# Altium schematic sheet InputConn.SchDoc
size A; SheetNumber: 4; SheetTotal: 4
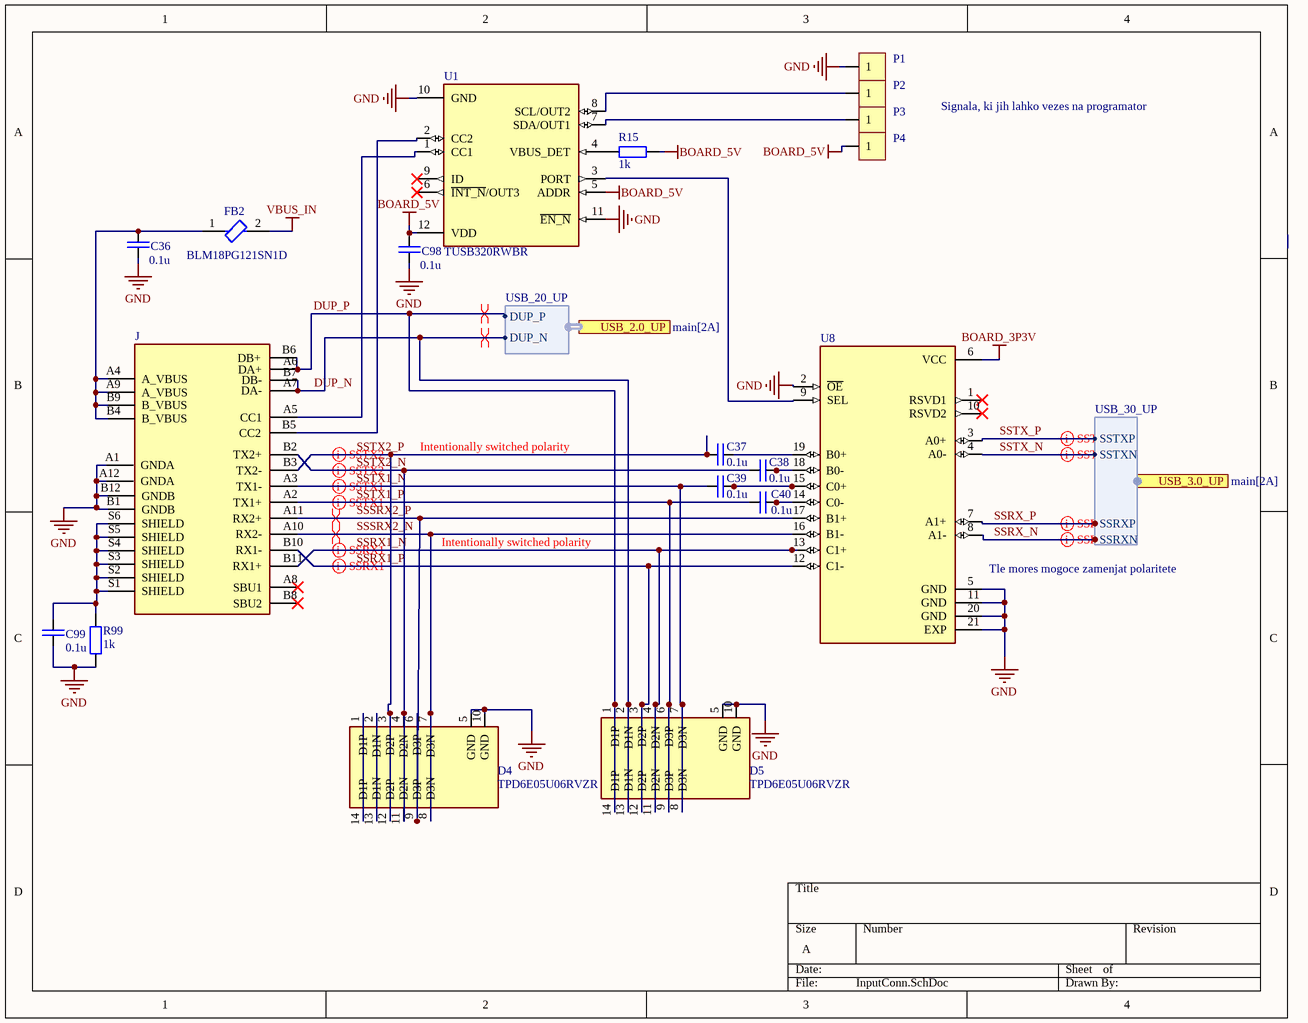
[diagram p0: InputConn.SchDoc]

## Parts
C36  value 0.1u  [CAP_0603_N]  (hidden comment: comment)
C37  value 0.1u  [CAP_0603_N]  (hidden comment: comment)
C38  value 0.1u  [CAP_0603_N]  (hidden comment: comment)
C39  value 0.1u  [CAP_0603_N]  (hidden comment: comment)
C40  value 0.1u  [CAP_0603_N]  (hidden comment: comment)
C98  value 0.1u  [CAP_0603_N]  (hidden comment: comment)
C99  value 0.1u  [CAP_0603_N]  (hidden comment: comment)
D4  TPD6E05U06RVZR  [SON50P135X350X55-14N]
D5  TPD6E05U06RVZR  [SON50P135X350X55-14N]
FB2  BLM18PG121SN1D  [FP-BLM18-0_15-t0_8-IPC_B]
J  (no value)  [JAE_DX07B024JJ3R1600]
P1  H1x1  [HDR1X1]  (value not drawn)
P2  H1x1  [HDR1X1]  (value not drawn)
P3  H1x1  [HDR1X1]  (value not drawn)
P4  H1x1  [HDR1X1]  (value not drawn)
R15  value 1k  [SMD_0603_N]  (hidden comment: comment)
R99  value 1k  [SMD_0603_N]  (hidden comment: comment)
U1  TUSB320RWBR  [IC_TUSB320RWBR]
U8  (no value)  [QFN50P450X250X100-21N]

## Ports
USB_2.0_UP (harness USB_20_UP, see main[2A]), USB_3.0_UP (harness USB_30_UP, see main[2A])

## Harnesses
USB_30_UP: SSTXP, SSTXN, SSRXP, SSRXN
USB_20_UP: DUP_P, DUP_N

## Nets
BOARD_3P3V: U8.6(VCC)
BOARD_5V: C98.1 P4.1 R15.2 U1.5(ADDR) U1.12(VDD)
GND: C36.2 C98.2 C99.1 D4.5(GND) D4.10(GND) D5.5(GND) D5.10(GND) J.A1(GNDA) J.A12(GNDA) J.B1(GNDB) J.B12(GNDB) P1.1 R99.1 U1.10(GND) U1.11(~{EN_N}) U8.2(~{OE}) U8.5(GND) U8.11(GND) U8.20(GND) U8.21(EXP)
VBUS_IN: FB2.2
DUP_N: D5.2(D1N) D5.13(D1N) J.A7(DA-) J.B7(DB-) ; port USB_2.0_UP.DUP_N
DUP_P: D5.1(D1P) D5.14(D1P) J.A6(DA+) J.B6(DB+) ; port USB_2.0_UP.DUP_P
SSRX1_N: D5.4(D2N) D5.11(D2N) J.B11(RX1+) U8.13(C1+)
SSRX1_P: D5.3(D2P) D5.12(D2P) J.B10(RX1-) U8.12(C1-)
SSRX_N: U8.8(A1-) ; port USB_3.0_UP.SSRXN
SSRX_P: U8.7(A1+) ; port USB_3.0_UP.SSRXP
SSSRX2_N: D4.7(D3N) D4.8(D3N) J.A10(RX2-) U8.16(B1-)
SSSRX2_P: D4.6(D3P) D4.9(D3P) J.A11(RX2+) U8.17(B1+)
SSTX1_N: C39.1 D5.7(D3N) D5.8(D3N) J.A3(TX1-)
SSTX1_P: C40.1 D5.6(D3P) D5.9(D3P) J.A2(TX1+)
SSTX2_N: C38.1 D4.4(D2N) D4.11(D2N) J.B2(TX2+)
SSTX2_P: C37.1 D4.3(D2P) D4.12(D2P) J.B3(TX2-)
SSTX_N: U8.4(A0-) ; port USB_3.0_UP.SSTXN
SSTX_P: U8.3(A0+) ; port USB_3.0_UP.SSTXP
NetC36_1: C36.1 FB2.1 J.A4(A_VBUS) J.A9(A_VBUS) J.B4(B_VBUS) J.B9(B_VBUS)
NetC37_2: C37.2 U8.19(B0+)
NetC38_2: C38.2 U8.18(B0-)
NetC39_2: C39.2 U8.15(C0+)
NetC40_2: C40.2 U8.14(C0-)
NetC99_2: C99.2 J.S1(SHIELD) J.S2(SHIELD) J.S3(SHIELD) J.S4(SHIELD) J.S5(SHIELD) J.S6(SHIELD) R99.2
NetD4_1: D4.1(D1P) D4.14(D1P)
NetD4_2: D4.2(D1N) D4.13(D1N)
NetJ_A5: J.A5(CC1) U1.1(CC1)
NetJ_B5: J.B5(CC2) U1.2(CC2)
NetP2_1: P2.1 U1.8(SCL/OUT2)
NetP3_1: P3.1 U1.7(SDA/OUT1)
NetR15_1: R15.1 U1.4(VBUS_DET)
NetU1_3: U1.3(PORT) U8.9(SEL)

Not connected (* = marked no-connect by the designer): J A8(SBU1)* B8(SBU2)*; U1 6(~{INT_N}/OUT3)* 9(ID)*; U8 1(RSVD1)* 10(RSVD2)*

## Layout directives
differential pair: DUP_N, DUP_P, SSRX1_N, SSRX1_P, SSRX_N, SSRX_P, SSSRX2_N, SSSRX2_P, SSTX1_N, SSTX1_P, SSTX2_N, SSTX2_P, SSTX_N, SSTX_P

## Notes on the sheet
- Signala, ki jih lahko vezes na programator
- Intentionally switched polarity
- (near U8) Tle mores mogoce zamenjat polaritete

## Library data of the parts
C36-C40 C98 C99 = Capacitor non-polarized
D4 D5 = TPD6E05U06RVZR: 6-Channel Ultra low capacitance IEC ESD protection diodes 14-USON -40 to 125; MP: TPD6E05U06RVZR; Price: None; Package: None; Value: *; Availability: Unavailable
FB2 = CMP-0686-00557-7: Chip Ferrite Bead, 0603, 120Ω @ 100MHz, 0.05Ω, 25%, 2A; Impedance: 120R; Number of Circuits: 1; Shielding: Unshielded; Material: Steel; DC Resistance (DCR): 50mR; Case Code (Imperial): 0603; RoHS Compliant: Yes; Number of Pins: 2; Min Operating Temperature: -55°C; Case Code (Metric): 1608; Frequency: 100MHz; Length: 1.6mm; Test Frequency: 100MHz; Max Operating Temperature: 125°C; Packaging: Tape and Reel; Max Current Rating: 2A; Termination: SMD/SMT; Lead Free: Lead Free; Max DC Current: 2A; Case/Package: 0603; Height: 0.8mm; Current Rating: 2A; Radiation Hardening: No; Core Material: Ferrite; DC Current: 2A; REACH SVHC: No SVHC; Package Quantity: 1; Depth: 0.8mm; Number of Lines: 1; Tolerance: 25%; Width: 0.8mm
J = DX07B024JJ3R1600: USB-C _USB TYPE-C_ USB 3.1 _USB 3.1 Gen 2, Superspeed+_ Receptacle Connector 24 Position Board Cutout, Surface Mount, Right Angle; Through Hole; MF: JAE Electronics; Availability: Unavailable; SnapEDA_Link: https://www.snapeda.com/parts/DX07B024JJ3R1600/JAE%20Electronics/view-part/631446/?ref=snap; MP: DX07B024JJ3R1600; Price: None; Package: None; Value: *
P1-P4 = Header 1X1: Value: value
R15 R99 = Resistor
U1 = TUSB320RWBR: USB Type-C configuration channel logic and port control; MF: Texas Instruments; SnapEDA_Link: https://www.snapeda.com/parts/TUSB320RWBR/Texas+Instruments/view-part/?ref=snap; Package: X2QFN-12 Texas Instruments; Value: *; MP: TUSB320RWBR; Check_prices: https://www.snapeda.com/parts/TUSB320RWBR/Texas+Instruments/view-part/?ref=eda
U8 = HD3SS3212RKSR: USB Switch IC 2 Channel 20-VQFN _4.5x2.5_; MF: Texas Instruments; Value: *; Availability: Unavailable; Package: VFQFN-20 Texas Instruments; SnapEDA_Link: https://www.snapeda.com/parts/HD3SS3212RKSR/Texas%20Instruments/view-part/563933/?ref=snap; Price: None; MP: HD3SS3212RKSR